# EAGLE design BB8 PCB (EAGLE 9.5.0)
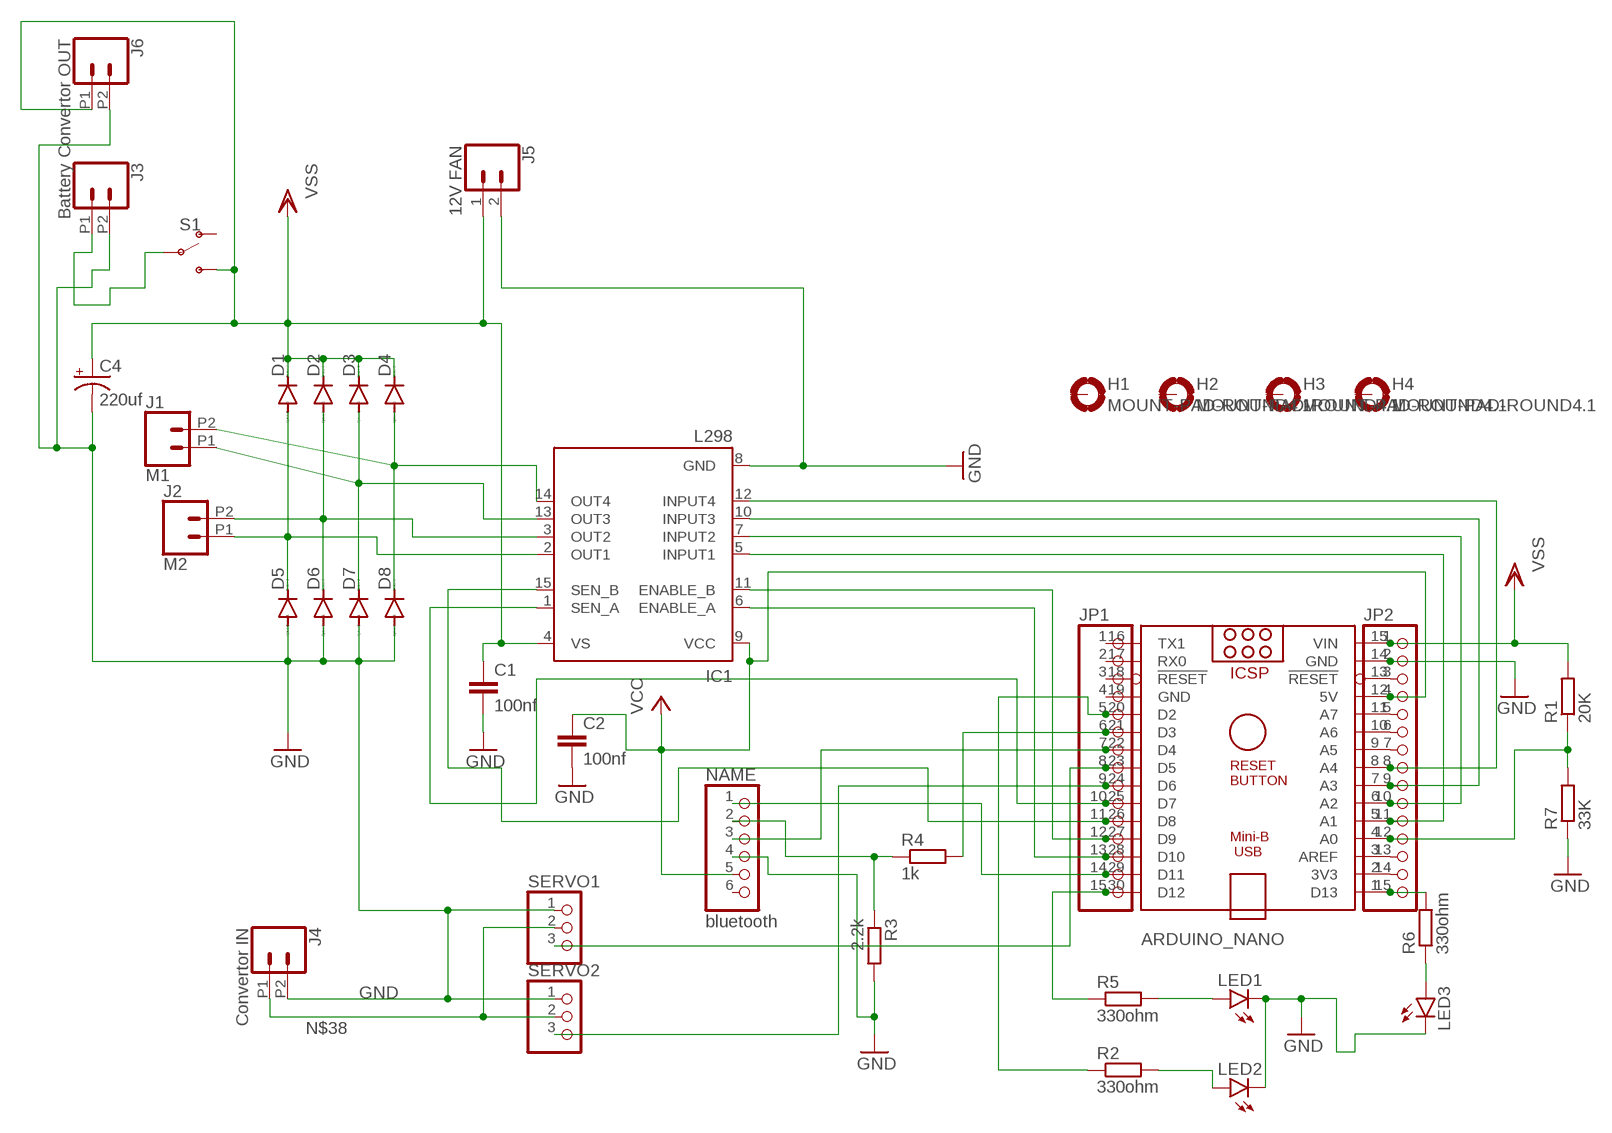
[diagram p0: schematic, sheet 1]

## Parts
ARDUINO_NANO  ARDUINO_NANO  [ARDUINO_NANO]
BLUETOOTH  bluetooth  PINHD-1X6  [1X06]
C1  100nf  C5/2.5  [C5B2.5]
C2  100nf  C5/2.5  [C5B2.5]
C4  220uf  CPOL-USE5-8.5  [E5-8,5]
D1  1N4148DO35-7  [DO35-7]
D2  1N4148DO35-7  [DO35-7]
D3  1N4148DO35-7  [DO35-7]
D4  1N4148DO35-7  [DO35-7]
D5  1N4148DO35-7  [DO35-7]
D6  1N4148DO35-7  [DO35-7]
D7  1N4148DO35-7  [DO35-7]
D8  1N4148DO35-7  [DO35-7]
H1  MOUNT-PAD-ROUND4.1  [4,1-PAD]
H2  MOUNT-PAD-ROUND4.1  [4,1-PAD]
H3  MOUNT-PAD-ROUND4.1  [4,1-PAD]
H4  MOUNT-PAD-ROUND4.1  [4,1-PAD]
IC1  L298  [MULTIWATT-15]
J1  M1  CONN_022.54MM_SCREWTERM  [1X02_2.54_SCREWTERM]
J2  M2  CONN_022.54MM_SCREWTERM  [1X02_2.54_SCREWTERM]
J3  Battery  CONN_022.54MM_SCREWTERM  [1X02_2.54_SCREWTERM]
J4  Convertor IN  CONN_022.54MM_SCREWTERM  [1X02_2.54_SCREWTERM]
J5  12V FAN  CONN_02  [1X02]
J6  Convertor OUT  CONN_022.54MM_SCREWTERM  [1X02_2.54_SCREWTERM]
JP1  PINHD-1X15  [1X15]
JP2  PINHD-1X15  [1X15]
LED1  LED5MM  [LED5MM]
LED2  LED5MM  [LED5MM]
LED3  LED5MM  [LED5MM]
R1  20K  R-EU_0204/7  [0204/7]
R2  330ohm  R-EU_0204/7  [0204/7]
R3  2.2k  R-EU_0204/7  [0204/7]
R4  1k  R-EU_0204/7  [0204/7]
R5  330ohm  R-EU_0204/7  [0204/7]
R6  330ohm  R-EU_0204/7  [0204/7]
R7  33K  R-EU_0204/7  [0204/7]
S1  SWITCH-SPDT-PTH-11.6X4.0MM-LOCK  [SWITCH_SPDT_PTH_11.6X4.0MM_LOCK]
SERVO1  PINHD-1X3  [1X03]
SERVO2  PINHD-1X3  [1X03]

## Nets
12V: ARDUINO_NANO.15(VIN) C1.1 C4.+ D1.C D2.C D3.C D4.C IC1.4(VS) J5.1 J6.P1 JP2.1 R1.2 S1.3(S) ; supply symbol labelled VSS
GND [Power]: ARDUINO_NANO.14(GND) BLUETOOTH.4 C1.2 C2.2 C4.- D5.A D6.A D7.A D8.A IC1.8(GND) J3.P2 J4.P2 J5.2 J6.P2 JP2.2 LED1.K(C) LED2.K(C) LED3.K(C) R3.2 R7.1 SERVO1.1 SERVO2.1
N$1: ARDUINO_NANO.21(D3) JP1.6 R4.2
N$2: BLUETOOTH.2 R3.1 R4.1
N$3: ARDUINO_NANO.22(D4) BLUETOOTH.3 JP1.7
N$4: ARDUINO_NANO.29(D11) BLUETOOTH.1 JP1.14
N$5: ARDUINO_NANO.23(D5) JP1.8 SERVO1.3
N$6: ARDUINO_NANO.24(D6) JP1.9 SERVO2.3
N$7 [New Class]: ARDUINO_NANO.28(D10) IC1.6(ENABLE_A) JP1.13
N$8 [New Class]: ARDUINO_NANO.6(A2) IC1.7(INPUT2) JP2.10
N$9: ARDUINO_NANO.5(A1) IC1.5(INPUT1) JP2.11
N$10: ARDUINO_NANO.8(A4) IC1.12(INPUT4) JP2.8
N$11: D1.A D5.C IC1.2(OUT1) J2.P1
N$12: D2.A D6.C IC1.3(OUT2) J2.P2
N$13 [New Class]: ARDUINO_NANO.25(D7) IC1.1(SEN_A) JP1.10
N$14: D3.A D7.C IC1.13(OUT3) J1.P1
N$15: D4.A D8.C IC1.14(OUT4) J1.P2
N$16: ARDUINO_NANO.30(D12) JP1.15 R5.1
N$17: LED1.A R5.2
N$18: LED2.A R2.2
N$19 [New Class]: ARDUINO_NANO.20(D2) JP1.5 R2.1
N$20: ARDUINO_NANO.1(D13) JP2.15 R6.2
N$21: LED3.A R6.1
N$22 [New Class]: ARDUINO_NANO.27(D9) IC1.11(ENABLE_B) JP1.12
N$23 [New Class]: ARDUINO_NANO.7(A3) IC1.10(INPUT3) JP2.9
N$24 [New Class]: ARDUINO_NANO.26(D8) IC1.15(SEN_B) JP1.11
N$25: ARDUINO_NANO.4(A0) JP2.12 R1.1 R7.2
N$26: ARDUINO_NANO.16(TX1) JP1.1
N$27: ARDUINO_NANO.17(RX0) JP1.2
N$28: ARDUINO_NANO.18(!RESET) JP1.3
N$29: ARDUINO_NANO.19(GND) JP1.4
N$30: ARDUINO_NANO.13(!RESET) JP2.3
N$32: ARDUINO_NANO.11(A7) JP2.5
N$33: ARDUINO_NANO.10(A6) JP2.6
N$34: ARDUINO_NANO.9(A5) JP2.7
N$35: ARDUINO_NANO.3(AREF) JP2.13
N$36: ARDUINO_NANO.2(3V3) JP2.14
N$37: J3.P1 S1.2(P)
N$38: J4.P1 SERVO1.2 SERVO2.2
VCC: ARDUINO_NANO.12(5V) BLUETOOTH.5 C2.1 IC1.9(VCC) JP2.4
Unconnected: BLUETOOTH.6 H1.B4,1(MOUNT) H2.B4,1(MOUNT) H3.B4,1(MOUNT) H4.B4,1(MOUNT) S1.1(O)

## Library data of the parts
ARDUINO_NANO = ArduinoNanoV30:ARDUINO_NANO: Arduino Nano V3.0 Overview: The Arduino Nano is a small, complete, and breadboard-friendly board based on the ATmega328 (Arduino Nano 3.x) or ATmega168 (Arduino Nano 2.x). It has more or less the same functionality of the Arduino Duemilanove, but in a different package. It lacks only a DC power jack, and works with a Mini-B USB cable instead of a standard one. The Nano was designed and is being produced by Gravitech. Specifications: Microcontroller Atmel ATmega168 or ATmega328 Operating Voltage (logic level) 5 V Input Voltage (recommended) 7-12 V Input Voltage (limits) 6-20 V Digital I/O Pins 14 (of which 6 provide PWM output) Analog Input Pins 8 DC Current per I/O Pin 40 mA Flash Memory 16 KB (ATmega168) or 32 KB (ATmega328) of which 2 KB used by bootloader SRAM 1 KB (ATmega168) or 2 KB (ATmega328) EEPROM 512 bytes (ATmega168) or 1 KB (ATmega328) Clock Speed 16 MHz Dimensions 0.73" x 1.70" Length 45 mm Width 18 mm Weigth 5 g Power: The Arduino Nano can be powered via the Mini-B USB connection, 6-20V unregulated external power supply (pin 30), or 5V regulated external power supply (pin 27). The power source is automatically selected to the highest voltage source. Memory: The ATmega168 has 16 KB of flash memory for storing code (of which 2 KB is used for the bootloader); the ATmega328 has 32 KB, (also with 2 KB used for the bootloader). The ATmega168 has 1 KB of SRAM and 512 bytes of EEPROM (which can be read and written with the EEPROM library); the ATmega328 has 2 KB of SRAM and 1 KB of EEPROM. Input and Output: Each of the 14 digital pins on the Nano can be used as an input or output, using pinMode(), digitalWrite(), and digitalRead() functions. They operate at 5 volts. Each pin can provide or receive a maximum of 40 mA and has an internal pull-up resistor (disconnected by default) of 20-50 kOhms. In addition, some pins have specialized functions. Visit Arduino - ArduinoBoardNano <https://www.arduino.cc/en/Main/ArduinoBoardNano>
BLUETOOTH = pinhead:PINHD-1X6: PIN HEADER
C1 C2 = capacitor-wima:C: CAPACITOR naming: grid - package width
C4 = rcl:CPOL-US: POLARIZED CAPACITOR, American symbol; SPICEPREFIX: C
D1-D8 = diode:1N4148: DIODE high speed (Philips)
H1-H4 = holes:MOUNT-PAD-ROUND: MOUNTING PAD, round
IC1 = st-microelectronics:L298: DUAL FULL-BRIDGE DRIVER; MPN: L298N; OC_FARNELL: 1589425; OC_NEWARK: 32M1527
J1-J6 = SparkFun-Connectors:CONN_02: Multi connection point. Often used as Generic Header-pin footprint for 0.1 inch spaced/style header connections On any of the 0.1 inch spaced packages, you can populate with these: Break Away Headers - Straight <https://www.sparkfun.com/products/116> (PRT-00116) Break Away Male Headers - Right Angle <https://www.sparkfun.com/products/553> (PRT-00553) Female Headers <https://www.sparkfun.com/products/115> (PRT-00115) Break Away Headers - Machine Pin <https://www.sparkfun.com/products/117> (PRT-00117) Break Away Female Headers - Swiss Machine Pin <https://www.sparkfun.com/products/743> (PRT-00743) For SCREWTERMINALS and SPRING TERMINALS visit here: Screw Terimnals on SparkFun.com <https://www.sparkfun.com/search/results?term=Screw+Terminals> (5mm/3.5mm/2.54mm spacing) This device is also useful as a general connection point to wire up your design to another part of your project. Our various solder wires solder well into these plated through hole pads. Hook-Up Wire - Assortment (Stranded, 22 AWG) <https://www.sparkfun.com/products/11375> (PRT-11375) Hook-Up Wire - Assortment (Solid Core, 22 AWG) <https://www.sparkfun.com/products/11367> (PRT-11367) View the entire wire category on our website here <https://www.sparkfun.com/categories/141> Special notes: Molex polarized connector foot print use with: PRT-08233 with associated crimp pins and housings. 2.54_SCREWTERM for use with PRT-10571. 3.5mm Screw Terminal footprints for PRT-08084 5mm Screw Terminal footprints for use with PRT-08432
JP1 JP2 = pinhead:PINHD-1X15: PIN HEADER
LED1-LED3 = led:LED: LED OSRAM: - CHIPLED LG R971, LG N971, LY N971, LG Q971, LY Q971, LO R971, LY R971 LH N974, LH R974 LS Q976, LO Q976, LY Q976 LO Q996 - Hyper CHIPLED LW Q18S LB Q993, LB Q99A, LB R99A - SideLED LS A670, LO A670, LY A670, LG A670, LP A670 LB A673, LV A673, LT A673, LW A673 LH A674 LY A675 LS A676, LA A676, LO A676, LY A676, LW A676 LS A679, LY A679, LG A679 - Hyper Micro SIDELED® LS Y876, LA Y876, LO Y876, LY Y876 LT Y87S - SmartLED LW L88C, LW L88S LB L89C, LB L89S, LG L890 LS L89K, LO L89K, LY L89K LS L896, LA L896, LO L896, LY L896 - TOPLED LS T670, LO T670, LY T670, LG T670, LP T670 LSG T670, LSP T670, LSY T670, LOP T670, LYG T670 LG T671, LOG T671, LSG T671 LB T673, LV T673, LT T673, LW T673 LH T674 LS T676, LA T676, LO T676, LY T676, LB T676, LH T676, LSB T676, LW T676 LB T67C, LV T67C, LT T67C, LS T67K, LO T67K, LY T67K, LW E67C LS E67B, LA E67B, LO E67B, LY E67B, LB E67C, LV E67C, LT E67C LW T67C LS T679, LY T679, LG T679 LS T770, LO T770, LY T770, LG T770, LP T770 LB T773, LV T773, LT T773, LW T773 LH T774 LS E675, LA E675, LY E675, LS T675 LS T776, LA T776, LO T776, LY T776, LB T776 LHGB T686 LT T68C, LB T68C - Hyper Mini TOPLED® LB M676 - Mini TOPLED Santana® LG M470 LS M47K, LO M47K, LY M47K Source: http://www.osram.convergy.de LUXEON: - LUMILED® LXK2-PW12-R00, LXK2-PW12-S00, LXK2-PW14-U00, LXK2-PW14-V00 LXK2-PM12-R00, LXK2-PM12-S00, LXK2-PM14-U00 LXK2-PE12-Q00, LXK2-PE12-R00, LXK2-PE12-S00, LXK2-PE14-T00, LXK2-PE14-U00 LXK2-PB12-K00, LXK2-PB12-L00, LXK2-PB12-M00, LXK2-PB14-N00, LXK2-PB14-P00, LXK2-PB14-Q00 LXK2-PR12-L00, LXK2-PR12-M00, LXK2-PR14-Q00, LXK2-PR14-R00 LXK2-PD12-Q00, LXK2-PD12-R00, LXK2-PD12-S00 LXK2-PH12-R00, LXK2-PH12-S00 LXK2-PL12-P00, LXK2-PL12-Q00, LXK2-PL12-R00 Source: www.luxeon.com KINGBRIGHT: KA-3528ASYC Source: www.kingbright.com
R1-R7 = rcl:R-EU_: RESISTOR, European symbol; SPICEPREFIX: R
S1 = SparkFun-Switches:SWITCH-SPDT: Single Pole, Double Throw (SPDT) Switch Single-pole, double-throw (SPDT) switch. Variant Overview SMD-AYZ0202 Surface Mount DPDT Switch <https://www.sparkfun.com/products/597> (COM-00597) Used on e.g. LilyPad Arduino USB - ATmega32U4 Board <https://www.sparkfun.com/products/12049> PTH-11.6X4.0MM SPDT Mini Power Switch <https://www.sparkfun.com/products/102> (COM-00102) Used on e.g. SparkFun Simon Says - Through-Hole Soldering Kit <https://www.sparkfun.com/products/10547> (KIT-10547) PTH-11.6X4.0MM-KIT KIT version of SPDT Mini Power Switch - Simplifies soldering by removing tStop of switch pins - only one side can be soldered. PTH-11.6X4.0MM-LOCK LOCK version of SPDT Mini Power Switch - Offset pins hold switch in place for easier soldering. SMD-RIGHT-ANGLE Surface Mount Right Angle Switch <https://www.sparkfun.com/products/10860> (COM-10860) Used on e.g. SparkFun ESP8266 Thing <https://www.sparkfun.com/products/13231>; PROD_ID: SWCH-08261; SF_SKU: COM-00102
SERVO1 SERVO2 = pinhead:PINHD-1X3: PIN HEADER

## Net classes
1 New Class: width 0.635 mm, clearance 0.254 mm
2 Power: width 1.27 mm, clearance 0.254 mm

## Board
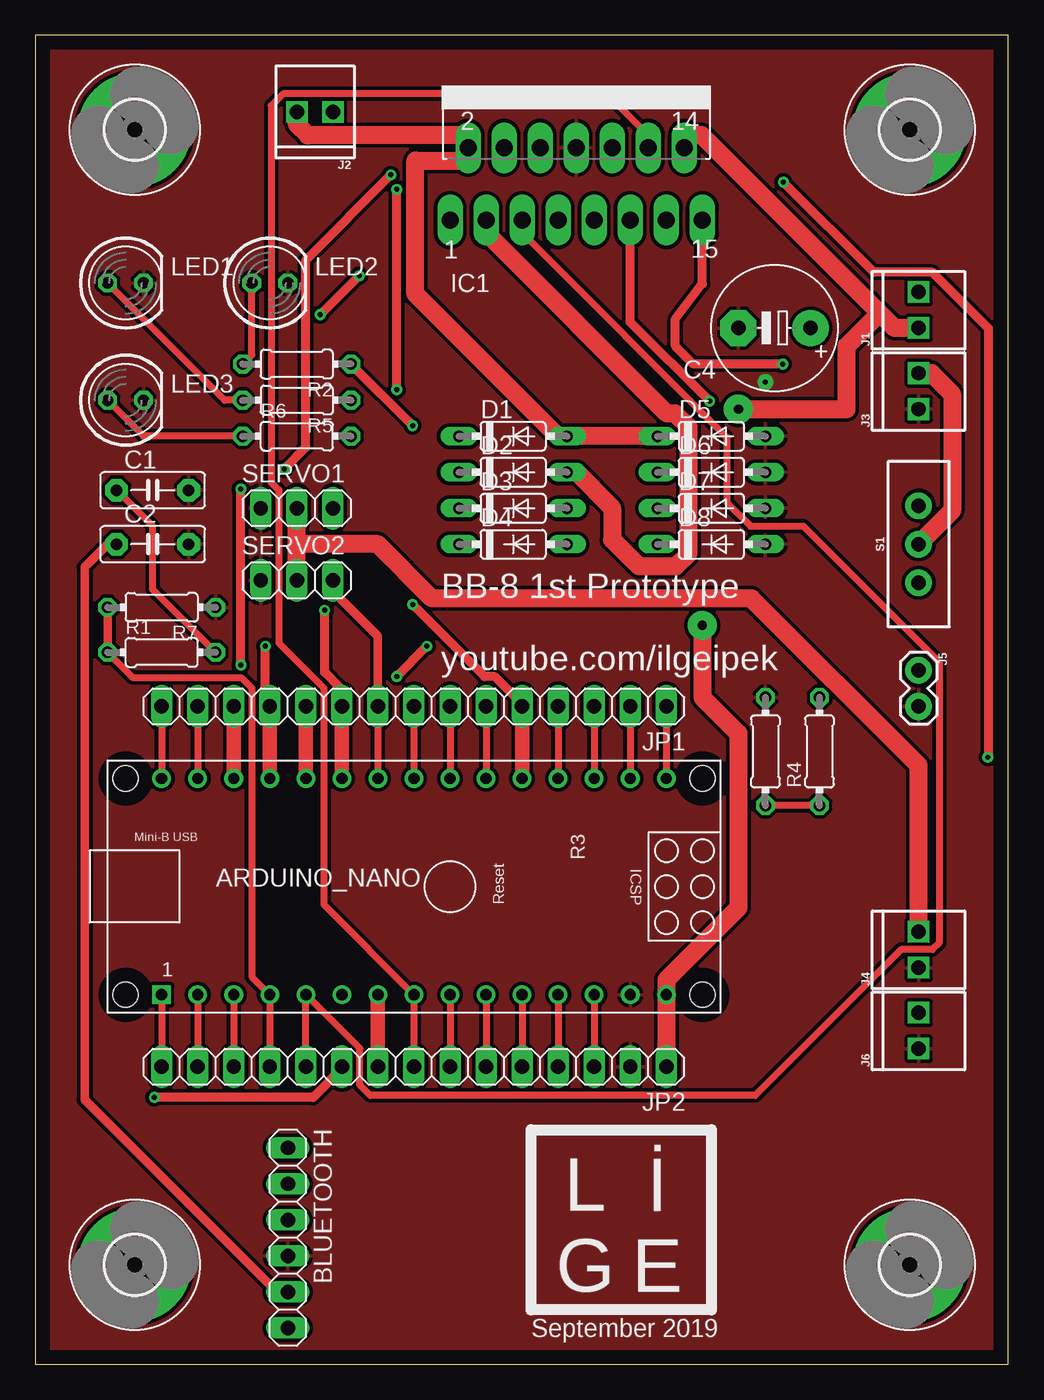
[diagram p1: board, top side]
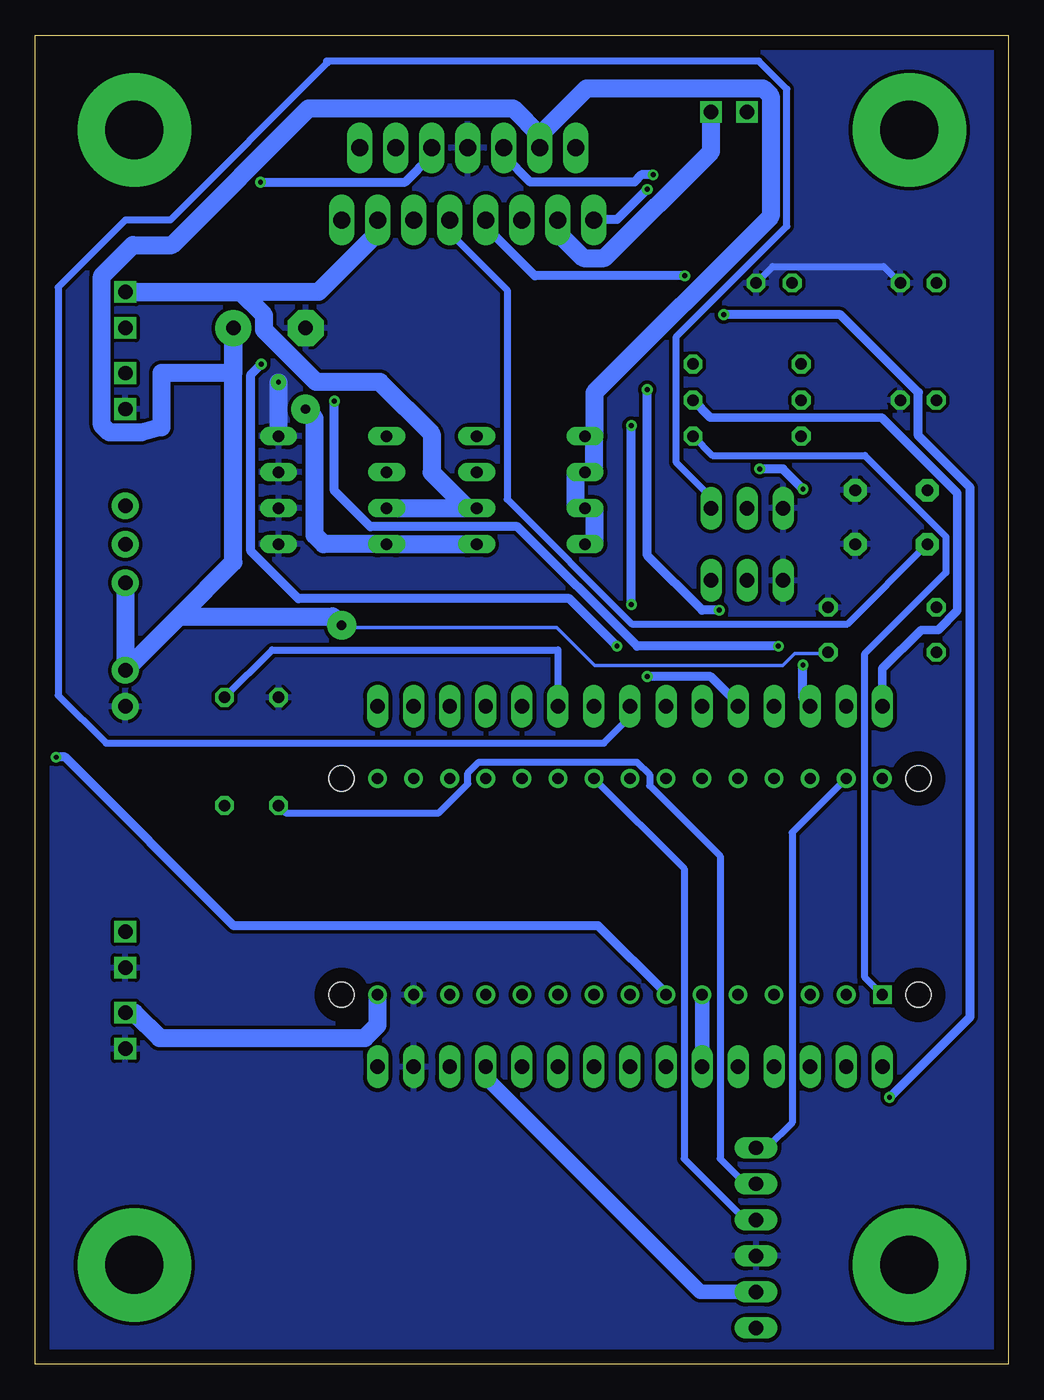
[diagram p2: board, bottom side, seen from below]

Size 68.56 x 93.65 mm. Coordinates in mm from the lower left corner, seen from the top.
Outline: 0,0 68.56,0 68.56,93.65 0,93.65 0,0
Copper layers (1*16): Top 0.035mm / dielectric 1.5mm / Bottom 0.035mm
Design rules "default *": minimum track width 6mil, minimum drill 0.35mm, track to track 10mil, track to pad 10mil, pad to pad 10mil, via to via 10mil, smd to smd 10mil, copper to edge 40mil, drill to drill 6mil, minimum pad ring 10mil, minimum via ring 8mil, stop-mask expansion 4mil, vias tented up to drill 0mil, thermal gap 10mil

### Footprints (pad centres in the part's own frame; a part is rotated, then mirrored left to right if it is on the bottom)
ARDUINO_NANO = drill 0.8 square: 1 -20.32,-7.62 | drill 0.8: 2 -17.78,-7.62; 3 -15.24,-7.62; 4 -12.7,-7.62; 5 -10.16,-7.62; 6 -7.62,-7.62; 7 -5.08,-7.62; 8 -2.54,-7.62; 9 0,-7.62; 10 2.54,-7.62; 11 5.08,-7.62; 12 7.62,-7.62; 13 10.16,-7.62; 14 12.7,-7.62; 15 15.24,-7.62; 16 15.24,7.62; 17 12.7,7.62; 18 10.16,7.62; 19 7.62,7.62; 20 5.08,7.62; 21 2.54,7.62; 22 0,7.62; 23 -2.54,7.62; 24 -5.08,7.62; 25 -7.62,7.62; 26 -10.16,7.62; 27 -12.7,7.62; 28 -15.24,7.62; 29 -17.78,7.62; 30 -20.32,7.62 | hole 1.778: -22.86,-7.62; -22.86,7.62; 17.78,7.62; 17.78,-7.62
1X06 = drill 1.016 long: 1 -6.35,0; 2 -3.81,0; 3 -1.27,0; 4 1.27,0; 5 3.81,0; 6 6.35,0
C5B2.5 = drill 0.813 pad 1.6 octagon: 1 -2.54,0; 2 2.54,0
E5-8,5 = drill 1.016 pad 2.54: + -2.54,0 | drill 1.016 pad 2.54 octagon: - 2.54,0
DO35-7 = drill 0.813 long: A 3.81,0; C -3.81,0
4,1-PAD = drill 4.1 pad 8: B4,1 0,0
MULTIWATT-15 = drill 1.2 long: 1 -8.89,-7.62; 2 -7.62,-2.54; 3 -6.35,-7.62; 4 -5.08,-2.54; 5 -3.81,-7.62; 6 -2.54,-2.54; 7 -1.27,-7.62; 8 0,-2.54; 9 1.27,-7.62; 10 2.54,-2.54; 11 3.81,-7.62; 12 5.08,-2.54; 13 6.35,-7.62; 14 7.62,-2.54; 15 8.89,-7.62
1X02_2.54_SCREWTERM = drill 1.016 square: P1 2.54,0; P2 0,0
1X02 = drill 1.016 pad 1.88: 1 0,0; 2 2.54,0
1X15 = drill 1.016 long: 1 -17.78,0; 2 -15.24,0; 3 -12.7,0; 4 -10.16,0; 5 -7.62,0; 6 -5.08,0; 7 -2.54,0; 8 0,0; 9 2.54,0; 10 5.08,0; 11 7.62,0; 12 10.16,0; 13 12.7,0; 14 15.24,0; 15 17.78,0
LED5MM = drill 0.813 octagon: A -1.27,0; K 1.27,0
0204/7 = drill 0.813 octagon: 1 -3.81,0; 2 3.81,0
SWITCH_SPDT_PTH_11.6X4.0MM_LOCK = drill 1.016 pad 1.88: 1 0,2.718; 2 0,0; 3 0,-2.718
1X03 = drill 1.016 long: 1 -2.54,0; 2 0,0; 3 2.54,0

### Placement (x,y rotation side)
ARDUINO_NANO  29.21,33.66 0 top
BLUETOOTH  17.78,8.89 270 top
C1  8.25,61.59 0 top
C2  8.25,57.78 0 top
C4  52.07,73.03 180 top
D1  33.66,65.41 0 top
D2  33.66,62.87 0 top
D3  33.66,60.33 0 top
D4  33.66,57.78 0 top
D5  47.62,65.41 0 top
D6  47.62,62.87 0 top
D7  47.62,60.33 0 top
D8  47.62,57.78 0 top
H1  6.98,6.99 0 top
H2  61.59,6.99 0 top
H3  6.98,87 0 top
H4  61.59,87 0 top
IC1  38.1,88.27 0 top
J1  62.23,73.03 90 top
J2  20.95,88.27 180 top
J3  62.23,67.31 90 top
J4  62.23,27.94 90 top
J5  62.23,48.9 270 top
J6  62.23,22.23 90 top
JP1  26.67,46.35 180 top
JP2  26.67,20.95 180 top
LED1  6.35,76.2 0 top
LED2  16.51,76.2 0 top
LED3  6.35,67.94 0 top
R1  8.89,50.16 0 top
R2  18.41,70.48 180 top
R3  51.44,43.18 90 top
R4  55.24,43.18 90 top
R5  18.41,67.94 180 top
R6  18.41,65.41 0 top
R7  8.89,53.34 180 top
S1  62.23,57.78 0 top
SERVO1  18.41,60.33 0 top
SERVO2  18.41,55.24 0 top

### Tracks (layer width: path | path; a pad name or v marks a point on that pad's centre or on a via)
12V  (via drill 0.65 pad 2.03)
  Top 0.508: R1.2 8.25,54.61 8.25,59.05 C1.1
  Top 1.27: IC1.4 33.02,86.62 | JP2.1 ARDUINO_NANO.15 44.45,27.09 49.53,32.17 49.53,44.45 46.99,46.99 v46.99,52.07
  Bottom 0.152: 46.38,51.92 v46.99,52.07
  Bottom 0.254: 46.38,51.92 31.83,51.92 29.16,49.25 15.9,49.25 15.06,50.09 12.75,50.09 R1.2
  Bottom 1.27: S1.3 J5.1 58.42,52.7 | 33.02,86.62 29.73,89.92 17.28,89.92 16.76,89.39 16.76,80.89 29.19,68.47 29.19,65.41 | 33.02,86.62 34.9,88.51 49.31,88.51 58.93,78.88 61.69,78.88 63.88,76.69 63.88,66.18 63.36,65.66 61.1,65.66 59.69,66.04 59.69,69.85 54.61,69.85 C4.+ 54.61,56.52 58.42,52.7 | 33.02,86.62 IC1.4 | 29.19,65.41 29.19,62.87 D2.C 30.5,62.87 30.5,60.33 D3.C 29.19,60.33 29.19,57.78 D4.C | 29.19,65.41 D1.C | J6.P1 61.59,24.77 59.82,22.99 45.36,22.99 44.45,23.89 ARDUINO_NANO.15 | 58.42,52.7 47.62,52.7 v46.99,52.07
GND  (via drill 0.35 pad 1.1)
  Bottom 0.508: LED2.K 16.61,77.37 8.79,77.37 LED1.K
  Bottom 1.27: D5.A v51.44,69.22
  pour Top: 0,93.34 68.58,93.34 68.58,0 0,0
  pour Bottom (isolate 0.254): 0,93.34 68.58,93.34 68.58,0 0,0
N$1
  Top 0.508: JP1.6 ARDUINO_NANO.21
  Bottom 0.508: R4.2 51.89,50.34 31.75,50.34 JP1.6
N$2
  Top 0.508: R4.1 R3.1
  Bottom 0.508: R3.1 50.93,38.86 40.14,38.86 38.1,40.9 38.1,41.65 37.31,42.44 26.19,42.44 25.29,41.54 25.29,40.78 20.32,35.81 20.32,14.48 18.54,12.7 BLUETOOTH.2
N$3
  Top 0.508: JP1.7 ARDUINO_NANO.22
  Bottom 0.508: ARDUINO_NANO.22 22.86,34.92 22.86,14.48 18.54,10.16 BLUETOOTH.3
N$4
  Top 0.508: JP1.14 ARDUINO_NANO.29
  Bottom 0.508: ARDUINO_NANO.29 15.24,37.47 15.24,17.02 17.02,15.24 BLUETOOTH.1
N$5
  Top 0.508: JP1.8 ARDUINO_NANO.23
  Bottom 0.508: SERVO1.3 20.95,61.09 23.39,63.52 23.39,72.42 15.62,80.2 15.62,89.87 17.59,91.84 48.07,91.84 47.99,91.71 59.05,80.64 62.23,80.64 66.97,75.91 66.97,47.14 63.59,43.76 28.5,43.76 26.67,45.59 JP1.8
N$6
  Top 0.508: JP1.9 ARDUINO_NANO.24
  Top 0.61: SERVO2.3 20.95,54.48 24.13,51.31 JP1.9
N$7  (via drill 0.35)
  Top 0.635: v25.04,83.82 19.05,77.83 19.05,64.62 v17.53,63.09 | v14.48,49.28 v14.48,61.67
  Top 1.016: JP1.13 ARDUINO_NANO.28
  Bottom 0.635: v25.04,83.82 25.86,83.82 26.36,83.31 33.68,83.31 35.51,85.14 35.51,85.65 IC1.6 | v17.53,63.09 15.9,63.09 v14.48,61.67 | v14.48,49.28 14.48,46.94 13.97,46.43 JP1.13
N$8  (via drill 0.35)
  Top 0.635: v20.07,73.97 v22.81,76.71 | v8.38,18.8 19.56,18.8 21.59,20.83 JP2.10
  Bottom 0.635: IC1.7 36.83,80.16 33.38,76.71 v22.81,76.71 | v20.07,73.97 11.84,73.97 6.35,68.48 6.35,65.43 2.69,61.77 2.69,24.49 v8.38,18.8
  Bottom 1.016: ARDUINO_NANO.6 JP2.10
N$9
  Top 0.508: IC1.5 34.29,79.75 48.72,65.31 48.72,60.73 50.39,59.05 54.12,59.05 63.68,49.49 63.68,29.68 63.2,29.21 60.99,29.21 50.7,18.92 23.6,18.92 22.86,19.67 22.86,22.24 19.07,26.04 ARDUINO_NANO.5 JP2.11
N$10
  Top 0.508: IC1.12 43.18,86.62 40.27,89.53 17.44,89.53 16.61,88.7 16.61,62.15 17.14,61.61 17.14,50.82 20.32,47.64 20.32,32.38 ARDUINO_NANO.8 JP2.8
N$11
  Top 1.27: J2.P1 18.41,87.37 19.17,86.61 30.47,86.61 30.48,86.62 IC1.2 30.48,84.83 26.77,84.83 26.77,75.44 36.8,65.41 D1.A D5.C
N$12
  Top 0.152: 46.02,62.89 43.84,62.89 D6.C
  Top 1.27: D2.A 38.12,62.87 40.64,60.35 40.64,58.11 42.51,56.24 45.12,56.24 46.02,57.14 46.02,62.89 46.02,66.05 45.06,67.01 44.49,67.01 31.75,79.75 IC1.3
  Bottom 1.27: IC1.3 31.75,79.75 29.96,77.96 28.47,77.96 20.95,85.47 J2.P2
N$13  (via drill 0.35)
  Top 0.635: v25.45,68.68 v25.45,82.8 | v20.37,53.14 20.37,48.77 21.49,47.65 21.49,46.53 JP1.10
  Top 1.016: JP1.10 ARDUINO_NANO.25
  Bottom 0.635: v25.45,82.8 27.58,80.67 29.21,80.67 IC1.1 | v25.45,68.68 25.45,57 21.59,53.14 v20.37,53.14
N$14
  Bottom 1.27: IC1.13 44.45,79.75 48.63,75.56 J1.P1 54.1,75.56 52.45,73.92 52.45,72.89 48.78,69.23 44.29,69.23 40.64,65.57 40.64,62.84 38.12,60.33 D3.A D7.C
N$15  (via drill 0.65 pad 2.03)
  Top 1.27: J1.P2 60.54,73.03 59.48,74.08 | 59.48,74.08 46.94,86.62 45.72,86.62 IC1.14 | 59.48,74.08 57.15,71.75 57.15,67.31 v49.53,67.31
  Bottom 1.27: D4.A D8.C 48.26,57.78 48.89,58.42 48.89,66.67 v49.53,67.31
N$16
  Top 0.508: JP1.15 ARDUINO_NANO.30
  Bottom 0.61: R5.1 21.01,66.73 8.92,66.73 3.59,61.4 3.59,53.1 4.94,51.75 6.16,51.75 8.89,49.02 JP1.15
N$17
  Top 0.508: R5.2 13.33,67.94 LED1.A
N$18
  Top 0.508: R2.2 15.24,71.12 LED2.A
N$19  (via drill 0.35)
  Top 0.635: v26.57,66.14 R2.1 | v26.57,53.54 31.65,48.46 32.36,48.46 34.29,46.53 JP1.5
  Top 1.016: JP1.5 ARDUINO_NANO.20
  Bottom 0.635: v26.57,53.54 v26.57,66.14
N$20
  Top 0.508: ARDUINO_NANO.1 JP2.15
  Bottom 0.508: R6.2 20.86,64.04 10.12,64.04 4.41,58.33 4.41,55.79 10.16,50.03 10.16,27.3 ARDUINO_NANO.1
N$21
  Top 0.508: R6.1 7.62,65.41 LED3.A
N$22  (via drill 0.35)
  Top 0.635: IC1.11 41.91,73.46 v47.5,67.87 | v16.2,50.6 16.2,46.74 16.41,46.53 JP1.12
  Top 1.016: JP1.12 ARDUINO_NANO.27
  Bottom 0.635: v47.5,67.87 47.5,61.57 44.96,59.03 34.59,59.03 26.16,50.6 v16.2,50.6
N$23  (via drill 0.35)
  Top 0.635: v52.7,83.31 59.05,76.96 63.19,76.96 67.16,73 67.16,42.82 v67.11,42.77
  Top 1.016: ARDUINO_NANO.7 JP2.9
  Bottom 0.635: v52.7,83.31 42.52,83.31 40.69,85.14 40.69,85.65 IC1.10 | v67.11,42.77 66.47,42.77 54.58,30.89 28.91,30.89 24.13,26.11 ARDUINO_NANO.7
N$24  (via drill 0.35)
  Top 0.635: IC1.15 46.99,76.15 45.08,73.66 45.08,71.75 46.36,70.48 v52.65,70.48 | v25.45,48.46 v27.58,50.6
  Top 1.016: JP1.11 ARDUINO_NANO.26
  Bottom 0.635: v52.65,70.48 53.39,69.75 53.39,57.3 50.04,53.95 30.94,53.95 v27.58,50.6 | v25.45,48.46 20.98,48.46 19.05,46.53 JP1.11
N$25
  Top 0.508: JP2.12 ARDUINO_NANO.4 15.24,27.3 15.24,47.64 14.5,48.39 6.86,48.39 R1.1
  Top 0.61: R7.2 R1.1
N$26
  Top 0.508: JP1.1 ARDUINO_NANO.16
N$27
  Top 0.508: JP1.2 ARDUINO_NANO.17
N$28
  Top 0.508: JP1.3 ARDUINO_NANO.18
N$29
  Top 0.508: JP1.4 ARDUINO_NANO.19
N$30
  Top 0.508: ARDUINO_NANO.13 JP2.3
N$32
  Top 0.508: ARDUINO_NANO.11 JP2.5
N$33
  Top 0.508: ARDUINO_NANO.10 JP2.6
N$34
  Top 0.508: ARDUINO_NANO.9 JP2.7
N$35
  Top 0.508: ARDUINO_NANO.3 JP2.13
N$36
  Top 0.508: ARDUINO_NANO.2 JP2.14
N$37
  Top 1.27: J3.P1 63.13,69.85 64.59,68.39 64.59,60.15 S1.2
N$38
  Top 1.27: J4.P1 62.23,42.2 50.45,53.98 27.94,53.98 24.13,57.78 18.41,57.78 | 18.41,57.78 SERVO1.2 | SERVO2.2 18.41,57.78
VCC
  Top 0.508: ARDUINO_NANO.12 JP2.4
  Top 0.61: C2.1 5.08,57.78 3.47,56.17 3.47,18.63 17.02,5.08 BLUETOOTH.5
  Bottom 0.508: IC1.9 39.37,79.75 35.33,75.71 35.33,60.96 26.54,52.17 11.33,52.17 C2.1
  Bottom 1.016: JP2.4 36.83,20.19 21.72,5.08 BLUETOOTH.5

### Text on the board
tPlace: BB-8 1st Prototype | youtube.com/ilgeipek | L | İ | G | E | September 2019